# Altium project Aquarium_LED_Driver.PrjPCB
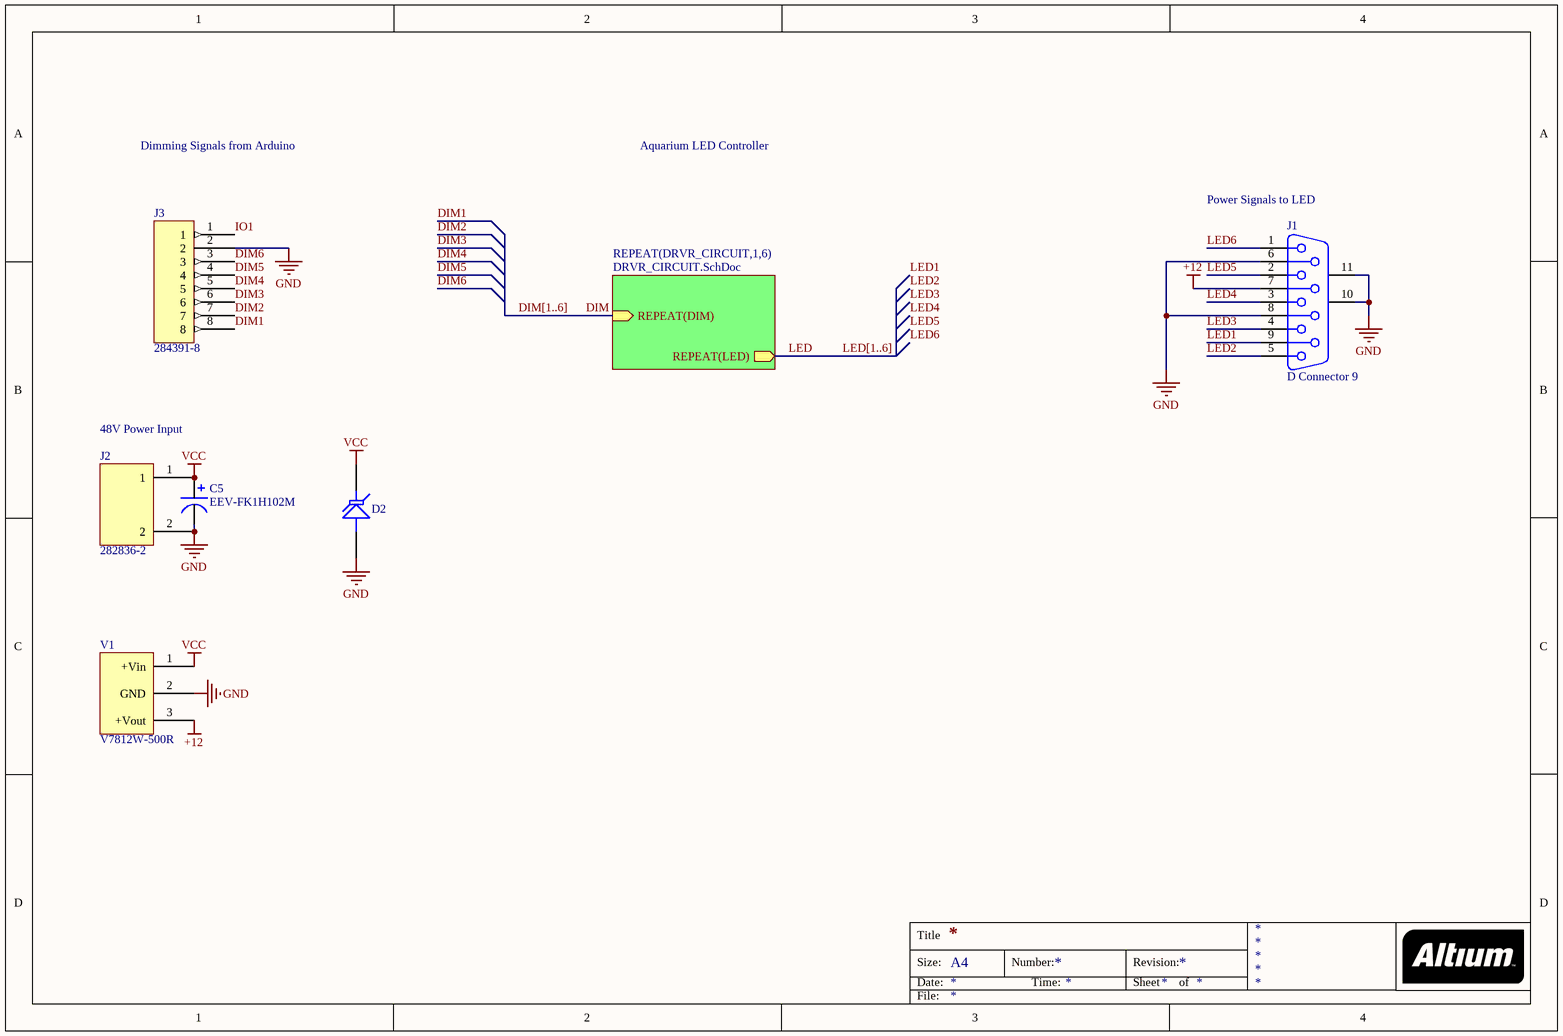
[diagram p0: Aquarium_LED_Driver.SchDoc]
2 sheets, 96 parts. Net scope: hierarchical (ports join the sheet entries above them; power ports are global).
Board file: Aquarium_LED_Driver.PcbDoc
Sheets:
  Aquarium_LED_Driver.SchDoc
    DRVR_CIRCUIT1 = DRVR_CIRCUIT.SchDoc
    DRVR_CIRCUIT2 = DRVR_CIRCUIT.SchDoc
    DRVR_CIRCUIT3 = DRVR_CIRCUIT.SchDoc
    DRVR_CIRCUIT4 = DRVR_CIRCUIT.SchDoc
    DRVR_CIRCUIT5 = DRVR_CIRCUIT.SchDoc
    DRVR_CIRCUIT6 = DRVR_CIRCUIT.SchDoc

## Sheet Aquarium_LED_Driver.SchDoc
size A4

### Parts
C5  EEV-FK1H102M  [EEV-FK1H102M]
D2  Tranzorb  [SMB]  (value not drawn)
J1  D Connector 9  [DSUB1.385-2H9]
J2  282836-2  [282836-2]
J3  284391-8  [284391-8]
V1  V7812W-500R  [V7812W-500R]

### Sub-sheets
REPEAT(DRVR_CIRCUIT,1,6) = DRVR_CIRCUIT.SchDoc: REPEAT(LED) (out), REPEAT(DIM) (in)

### Nets
+12: J1.7 V1.3(+Vout)
GND: C5.1(-) D2.1(A) J1.6 J1.8 J1.10(MH1) J1.11(MH2) J2.2 J3.2 V1.2(GND)
VCC: C5.2(+) D2.2(K) J2.1 V1.1(+Vin)
DIM: sheet REPEAT(DRVR_CIRCUIT,1,6)/REPEAT(DIM)
DIM1: J3.8
DIM2: J3.7
DIM3: J3.6
DIM4: J3.5
DIM5: J3.4
DIM6: J3.3
IO1: J3.1
LED: sheet REPEAT(DRVR_CIRCUIT,1,6)/REPEAT(LED)
LED1: J1.9
LED2: J1.5
LED3: J1.4
LED4: J1.3
LED5: J1.2
LED6: J1.1

### Buses and harness runs
bus DIM[1..6]
bus LED[1..6]

### Notes on the sheet
- Dimming Signals from Arduino
- Aquarium LED Controller
- (near J1) Power Signals to LED
- 48V Power Input
- Labels drawn without touching a wire or pin: LED1, LED2, LED3, LED4, LED5, LED6
- Title
- Size:
- Date:
- A4
- Number:
- Time:
- Revision:
- Sheet
- of
- File:

### Library data of the parts
C5 = EEV-FK1H102M: Aluminum Electrolytic Capcitor
D2 = Tranzorb: Transient Voltage Suppression (TVS) Diode; Published: 24-Mar-1999; LatestRevisionDate: 17-Jul-2002; LatestRevisionNote: Re-released for DXP Platform.; PackageReference: DO-7; Publisher: Altium Limited; PackageDescription: Axial Lead Diode
J1 = D Connector 9: Receptacle Assembly, 9 Position, Right Angle; PackageDocument: O; Positions: 9; Published: 15-Jun-2001; LatestRevisionDate: 17-Jul-2002; LatestRevisionNote: Re-released for DXP Platform.; DatasheetDocument: 1-Sep-1999; PackageReference: 788750; Publisher: Altium Limited; Orientation: Right Angle; Gender: Receptacle
J2 = 282836-2: Board Mount w/Interlock,  Low Profile,  5.0 mm Centerline,  Side Wire Entry
J3 = 284391-8: 8-Pos Eurostyle Terminal Block

## Sheet DRVR_CIRCUIT.SchDoc
size A
Used 6 times, as channels DRVR_CIRCUIT1, DRVR_CIRCUIT2, DRVR_CIRCUIT3, DRVR_CIRCUIT4, DRVR_CIRCUIT5, DRVR_CIRCUIT6. Parts and nets are listed once, with the designators drawn on the sheet.
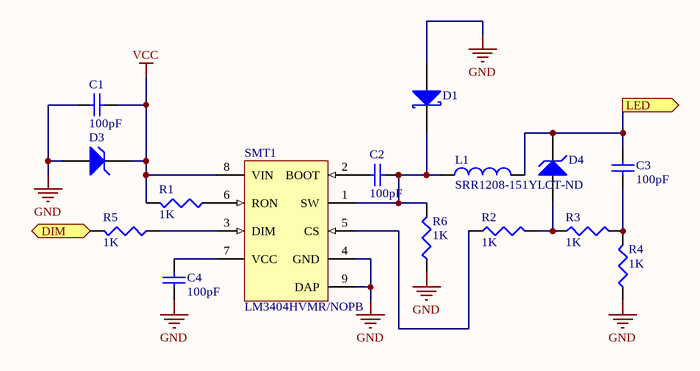
[diagram p1: DRVR_CIRCUIT.SchDoc]

### Parts
C1  value 100pF  [C1206]  (hidden comment: Cap Semi)
C2  value 100pF  [1608[0603]]  (hidden comment: Cap Semi)
C3  value 100pF  [C1206]  (hidden comment: Cap Semi)
C4  value 100pF  [1608[0603]]  (hidden comment: Cap Semi)
D1  D Schottky  [SMB]  (value not drawn)
D3  D Zener  [SMB]  (value not drawn)
D4  D Zener  [SMB]  (value not drawn)
L1  SRR1208-151YLCT-ND  [SRR1208-151YLCT-ND]
R1  value 1K  [J1-0603]  (hidden comment: Res3)
R2  value 1K  [J1-0603]  (hidden comment: Res3)
R3  value 1K  [J1-0603]  (hidden comment: Res3)
R4  value 1K  [J1-0603]  (hidden comment: Res3)
R5  value 1K  [J1-0603]  (hidden comment: Res3)
R6  value 1K  [J1-0603]  (hidden comment: Res3)
SMT1  LM3404HVMR/NOPB  [MRA08B_M]

### Ports
DIM (in), LED (out)

### Nets
GND: C1.1 C4.1 D1.1(A) D3.1(A) R4.1 R6.1 SMT1.4(GND) SMT1.9(DAP)
VCC: C1.2 D3.2(K) R1.2 SMT1.8(VIN)
DIM: R5.2 ; port DIM
LED: C3.2 D4.2(K) L1.2 ; port LED
NetC2_1: C2.1 SMT1.2(BOOT)
NetC2_2: C2.2 D1.2(K) L1.1 R6.2 SMT1.1(SW)
NetC3_1: C3.1 R3.2 R4.2
NetC4_2: C4.2 SMT1.7(VCC)
NetD4_1: D4.1(A) R2.2 R3.1
NetR1_1: R1.1 SMT1.6(RON)
NetR2_1: R2.1 SMT1.5(CS)
NetR5_1: R5.1 SMT1.3(DIM)

### Channels
DRVR_CIRCUIT1: designators C1=C1_DRVR_CIRCUIT1 C2=C2_DRVR_CIRCUIT1 C3=C3_DRVR_CIRCUIT1 C4=C4_DRVR_CIRCUIT1 D1=D1_1_DRVR_CIRCUIT1 D3=D3_DRVR_CIRCUIT1 D4=D4_DRVR_CIRCUIT1 L1=L1_DRVR_CIRCUIT1 R1=R1_DRVR_CIRCUIT1 R2=R2_DRVR_CIRCUIT1 R3=R3_DRVR_CIRCUIT1 R4=R4_DRVR_CIRCUIT1 R5=R5_DRVR_CIRCUIT1 R6=R6_DRVR_CIRCUIT1 SMT1=SMT1_DRVR_CIRCUIT1; ports DIM=DIM1 LED=LED1
DRVR_CIRCUIT2: designators C1=C1_DRVR_CIRCUIT2 C2=C2_DRVR_CIRCUIT2 C3=C3_DRVR_CIRCUIT2 C4=C4_DRVR_CIRCUIT2 D1=D1_1_DRVR_CIRCUIT2 D3=D3_DRVR_CIRCUIT2 D4=D4_DRVR_CIRCUIT2 L1=L1_DRVR_CIRCUIT2 R1=R1_DRVR_CIRCUIT2 R2=R2_DRVR_CIRCUIT2 R3=R3_DRVR_CIRCUIT2 R4=R4_DRVR_CIRCUIT2 R5=R5_DRVR_CIRCUIT2 R6=R6_DRVR_CIRCUIT2 SMT1=SMT1_DRVR_CIRCUIT2; ports DIM=DIM2 LED=LED2
DRVR_CIRCUIT3: designators C1=C1_DRVR_CIRCUIT3 C2=C2_DRVR_CIRCUIT3 C3=C3_DRVR_CIRCUIT3 C4=C4_DRVR_CIRCUIT3 D1=D1_1_DRVR_CIRCUIT3 D3=D3_DRVR_CIRCUIT3 D4=D4_DRVR_CIRCUIT3 L1=L1_DRVR_CIRCUIT3 R1=R1_DRVR_CIRCUIT3 R2=R2_DRVR_CIRCUIT3 R3=R3_DRVR_CIRCUIT3 R4=R4_DRVR_CIRCUIT3 R5=R5_DRVR_CIRCUIT3 R6=R6_DRVR_CIRCUIT3 SMT1=SMT1_DRVR_CIRCUIT3; ports DIM=DIM3 LED=LED3
DRVR_CIRCUIT4: designators C1=C1_DRVR_CIRCUIT4 C2=C2_DRVR_CIRCUIT4 C3=C3_DRVR_CIRCUIT4 C4=C4_DRVR_CIRCUIT4 D1=D1_1_DRVR_CIRCUIT4 D3=D3_DRVR_CIRCUIT4 D4=D4_DRVR_CIRCUIT4 L1=L1_DRVR_CIRCUIT4 R1=R1_DRVR_CIRCUIT4 R2=R2_DRVR_CIRCUIT4 R3=R3_DRVR_CIRCUIT4 R4=R4_DRVR_CIRCUIT4 R5=R5_DRVR_CIRCUIT4 R6=R6_DRVR_CIRCUIT4 SMT1=SMT1_DRVR_CIRCUIT4; ports DIM=DIM4 LED=LED4
DRVR_CIRCUIT5: designators C1=C1_DRVR_CIRCUIT5 C2=C2_DRVR_CIRCUIT5 C3=C3_DRVR_CIRCUIT5 C4=C4_DRVR_CIRCUIT5 D1=D1_1_DRVR_CIRCUIT5 D3=D3_DRVR_CIRCUIT5 D4=D4_DRVR_CIRCUIT5 L1=L1_DRVR_CIRCUIT5 R1=R1_DRVR_CIRCUIT5 R2=R2_DRVR_CIRCUIT5 R3=R3_DRVR_CIRCUIT5 R4=R4_DRVR_CIRCUIT5 R5=R5_DRVR_CIRCUIT5 R6=R6_DRVR_CIRCUIT5 SMT1=SMT1_DRVR_CIRCUIT5; ports DIM=DIM5 LED=LED5
DRVR_CIRCUIT6: designators C1=C1_DRVR_CIRCUIT6 C2=C2_DRVR_CIRCUIT6 C3=C3_DRVR_CIRCUIT6 C4=C4_DRVR_CIRCUIT6 D1=D1_1_DRVR_CIRCUIT6 D3=D3_DRVR_CIRCUIT6 D4=D4_DRVR_CIRCUIT6 L1=L1_DRVR_CIRCUIT6 R1=R1_DRVR_CIRCUIT6 R2=R2_DRVR_CIRCUIT6 R3=R3_DRVR_CIRCUIT6 R4=R4_DRVR_CIRCUIT6 R5=R5_DRVR_CIRCUIT6 R6=R6_DRVR_CIRCUIT6 SMT1=SMT1_DRVR_CIRCUIT6; ports DIM=DIM6 LED=LED6

### Library data of the parts
C1-C4 = Cap Semi: Capacitor (Semiconductor SIM Model); Published: 8-Jun-2000; LatestRevisionDate: 29-May-2009; LatestRevisionNote: IPC-7351 Footprint Added.; PackageReference: C1206; Publisher: Altium Limited; PackageDescription: Chip Capacitor
D1 = D Schottky: Schottky Diode; Published: 8-Jun-2000; LatestRevisionDate: 17-Jul-2002; LatestRevisionNote: Re-released for DXP Platform.; PackageReference: SMB; Publisher: Altium Limited; PackageDescription: DO-214-AA/SMB; 2 C-Bend Leads; Body 5.3 x 3.6 mm, inc. leads (LxW); Code_JEDEC: DO-214-AA
D3 D4 = D Zener: Zener Diode; Published: 8-Jun-2000; LatestRevisionDate: 17-Jul-2002; LatestRevisionNote: Re-released for DXP Platform.; PackageReference: DIODE-0.7; Publisher: Altium Limited; PackageDescription: Diode, Thru-Hole; 2 Leads; 0.7 in Pin Spacing
R1-R6 = Res3: Resistor; Published: 8-Jun-2000; LatestRevisionDate: 29-May-2009; LatestRevisionNote: IPC-7351 Footprint Added.; PackageReference: J1-0603; Publisher: Altium Limited; PackageDescription: Chip Resistor
SMT1 = LM3404HVMR/NOPB: 1.0A Constant Current Buck Regulator for High Power LED Drivers, 8-pin PSOP, Pb-Free; Manufacturer: National Semiconductor; PackageTopMarking: NSXYTT*L3404*HVMR; PowerWise: Y; CompType: MiscPower; Published: 1-Mar-2010; DatasheetVersion: Jun-2007; PackageVersion: revB, Dec-2007; PackageReference: MRA08B; Publisher: Altium Limited; PackageDescription: Molded, PSOP .193 x .154 x .058in, 8 Lead, .050in Pitch, Large DAP; Supplier 1: Digi-Key; Supplier Part Number 1: LM3404HVMR-ND; Supplier 2: Farnell; Supplier Part Number 2: 1364354; PartNumber: LM3404HVMR/NOPB; RoHS: Y; PinCount: 8; Code_JEDEC: MS-012-AA; ComponentLink1Description: LM3404HV Datasheet; ComponentLink1URL: http://www.national.com/ds/LM/LM3404HV.pdf; ComponentLink2Description: LM3404HV Web Page; ComponentLink2URL: http://www.national.com/pf/LM/LM3404HV.html; ComponentLink3Description: MRA08B Package Page; ComponentLink3URL: http://www.national.com/packaging/folders/mra08b.html

## Nets that join several sheets
GND: Aquarium_LED_Driver (9 pins), DRVR_CIRCUIT1 (8 pins), DRVR_CIRCUIT2 (8 pins), DRVR_CIRCUIT3 (8 pins), DRVR_CIRCUIT4 (8 pins), DRVR_CIRCUIT5 (8 pins), DRVR_CIRCUIT6 (8 pins)
VCC: Aquarium_LED_Driver (C5.2 D2.2 J2.1 V1.1), DRVR_CIRCUIT1 (C1_DRVR_CIRCUIT1.2 D3_DRVR_CIRCUIT1.2 R1_DRVR_CIRCUIT1.2 SMT1_DRVR_CIRCUIT1.8), DRVR_CIRCUIT2 (C1_DRVR_CIRCUIT2.2 D3_DRVR_CIRCUIT2.2 R1_DRVR_CIRCUIT2.2 SMT1_DRVR_CIRCUIT2.8), DRVR_CIRCUIT3 (C1_DRVR_CIRCUIT3.2 D3_DRVR_CIRCUIT3.2 R1_DRVR_CIRCUIT3.2 SMT1_DRVR_CIRCUIT3.8), DRVR_CIRCUIT4 (C1_DRVR_CIRCUIT4.2 D3_DRVR_CIRCUIT4.2 R1_DRVR_CIRCUIT4.2 SMT1_DRVR_CIRCUIT4.8), DRVR_CIRCUIT5 (C1_DRVR_CIRCUIT5.2 D3_DRVR_CIRCUIT5.2 R1_DRVR_CIRCUIT5.2 SMT1_DRVR_CIRCUIT5.8), DRVR_CIRCUIT6 (C1_DRVR_CIRCUIT6.2 D3_DRVR_CIRCUIT6.2 R1_DRVR_CIRCUIT6.2 SMT1_DRVR_CIRCUIT6.8)
DIM1: Aquarium_LED_Driver (J3.8), DRVR_CIRCUIT1 (R5_DRVR_CIRCUIT1.2)
DIM2: Aquarium_LED_Driver (J3.7), DRVR_CIRCUIT2 (R5_DRVR_CIRCUIT2.2)
DIM3: Aquarium_LED_Driver (J3.6), DRVR_CIRCUIT3 (R5_DRVR_CIRCUIT3.2)
DIM4: Aquarium_LED_Driver (J3.5), DRVR_CIRCUIT4 (R5_DRVR_CIRCUIT4.2)
DIM5: Aquarium_LED_Driver (J3.4), DRVR_CIRCUIT5 (R5_DRVR_CIRCUIT5.2)
DIM6: Aquarium_LED_Driver (J3.3), DRVR_CIRCUIT6 (R5_DRVR_CIRCUIT6.2)
LED1: Aquarium_LED_Driver (J1.9), DRVR_CIRCUIT1 (C3_DRVR_CIRCUIT1.2 D4_DRVR_CIRCUIT1.2 L1_DRVR_CIRCUIT1.2)
LED2: Aquarium_LED_Driver (J1.5), DRVR_CIRCUIT2 (C3_DRVR_CIRCUIT2.2 D4_DRVR_CIRCUIT2.2 L1_DRVR_CIRCUIT2.2)
LED3: Aquarium_LED_Driver (J1.4), DRVR_CIRCUIT3 (C3_DRVR_CIRCUIT3.2 D4_DRVR_CIRCUIT3.2 L1_DRVR_CIRCUIT3.2)
LED4: Aquarium_LED_Driver (J1.3), DRVR_CIRCUIT4 (C3_DRVR_CIRCUIT4.2 D4_DRVR_CIRCUIT4.2 L1_DRVR_CIRCUIT4.2)
LED5: Aquarium_LED_Driver (J1.2), DRVR_CIRCUIT5 (C3_DRVR_CIRCUIT5.2 D4_DRVR_CIRCUIT5.2 L1_DRVR_CIRCUIT5.2)
LED6: Aquarium_LED_Driver (J1.1), DRVR_CIRCUIT6 (C3_DRVR_CIRCUIT6.2 D4_DRVR_CIRCUIT6.2 L1_DRVR_CIRCUIT6.2)